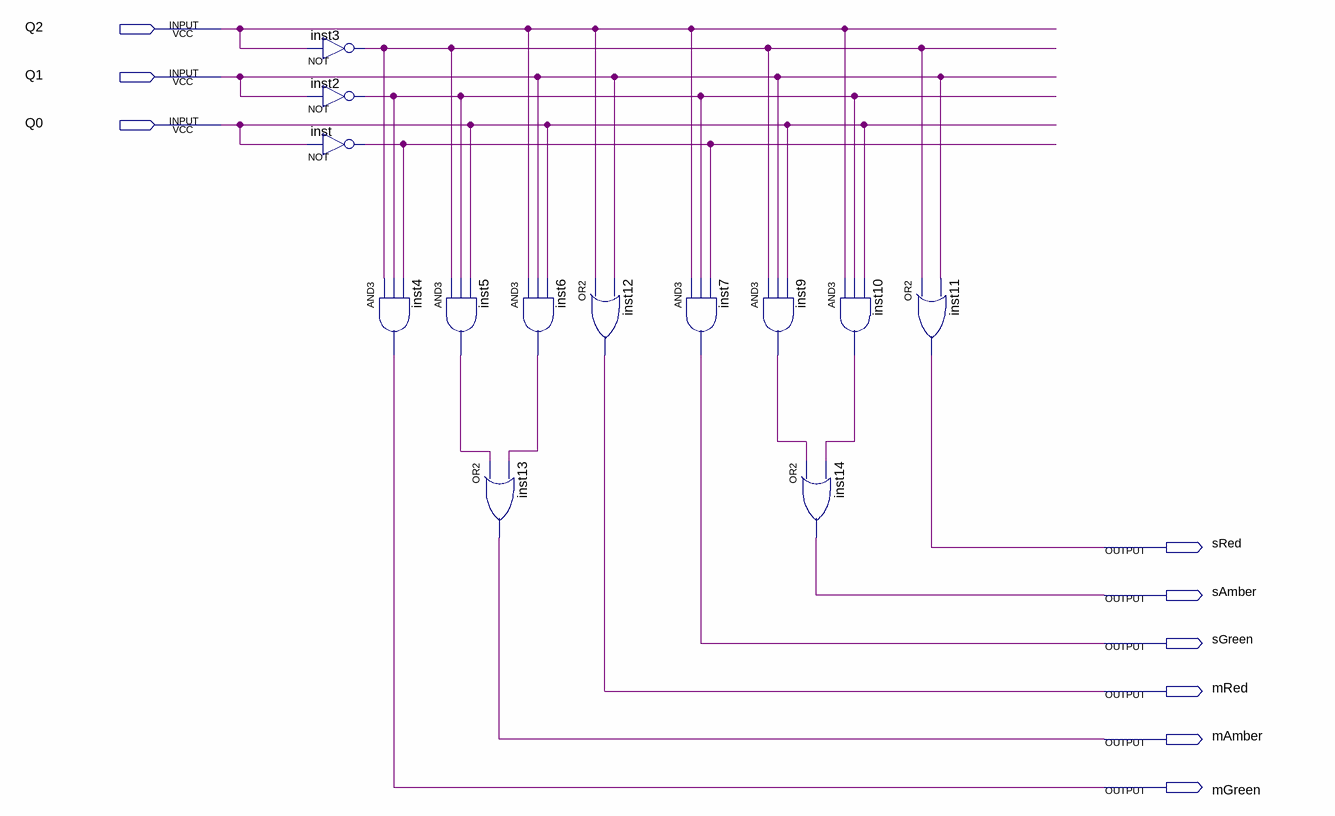
[diagram p0: schematic sheet]
// Quartus schematic TLdecoder.bdf as structural Verilog: 13 symbols, 9 pins
module TLdecoder (
  input  Q2,
  input  Q1,
  input  Q0,
  output sRed,
  output sAmber,
  output sGreen,
  output mRed,
  output mAmber,
  output mGreen
);

  wire inst2_out, inst3_out, inst5_out, inst6_out, inst9_out, inst10_out, inst_out;

  not inst3 (inst3_out, Q2);
  not inst2 (inst2_out, Q1);
  not inst (inst_out, Q0);
  and inst4 (mGreen, inst3_out, inst2_out, inst_out);
  and inst5 (inst5_out, inst3_out, inst2_out, Q0);
  or inst13 (mAmber, inst5_out, inst6_out);
  and inst6 (inst6_out, Q2, Q1, Q0);
  or inst12 (mRed, Q2, Q1);
  and inst7 (sGreen, Q2, inst2_out, inst_out);
  and inst9 (inst9_out, inst3_out, Q1, Q0);
  or inst14 (sAmber, inst9_out, inst10_out);
  and inst10 (inst10_out, Q2, inst2_out, Q0);
  or inst11 (sRed, inst3_out, Q1);
endmodule
